# Altium schematic sheet S7CAS-PLEIADES-CARTE-MERE_Pxx_CNA.SchDoc
size Tabloid; SheetNumber: 11; SheetTotal: 18; Sheet_Name: CNA; Size: 11x17
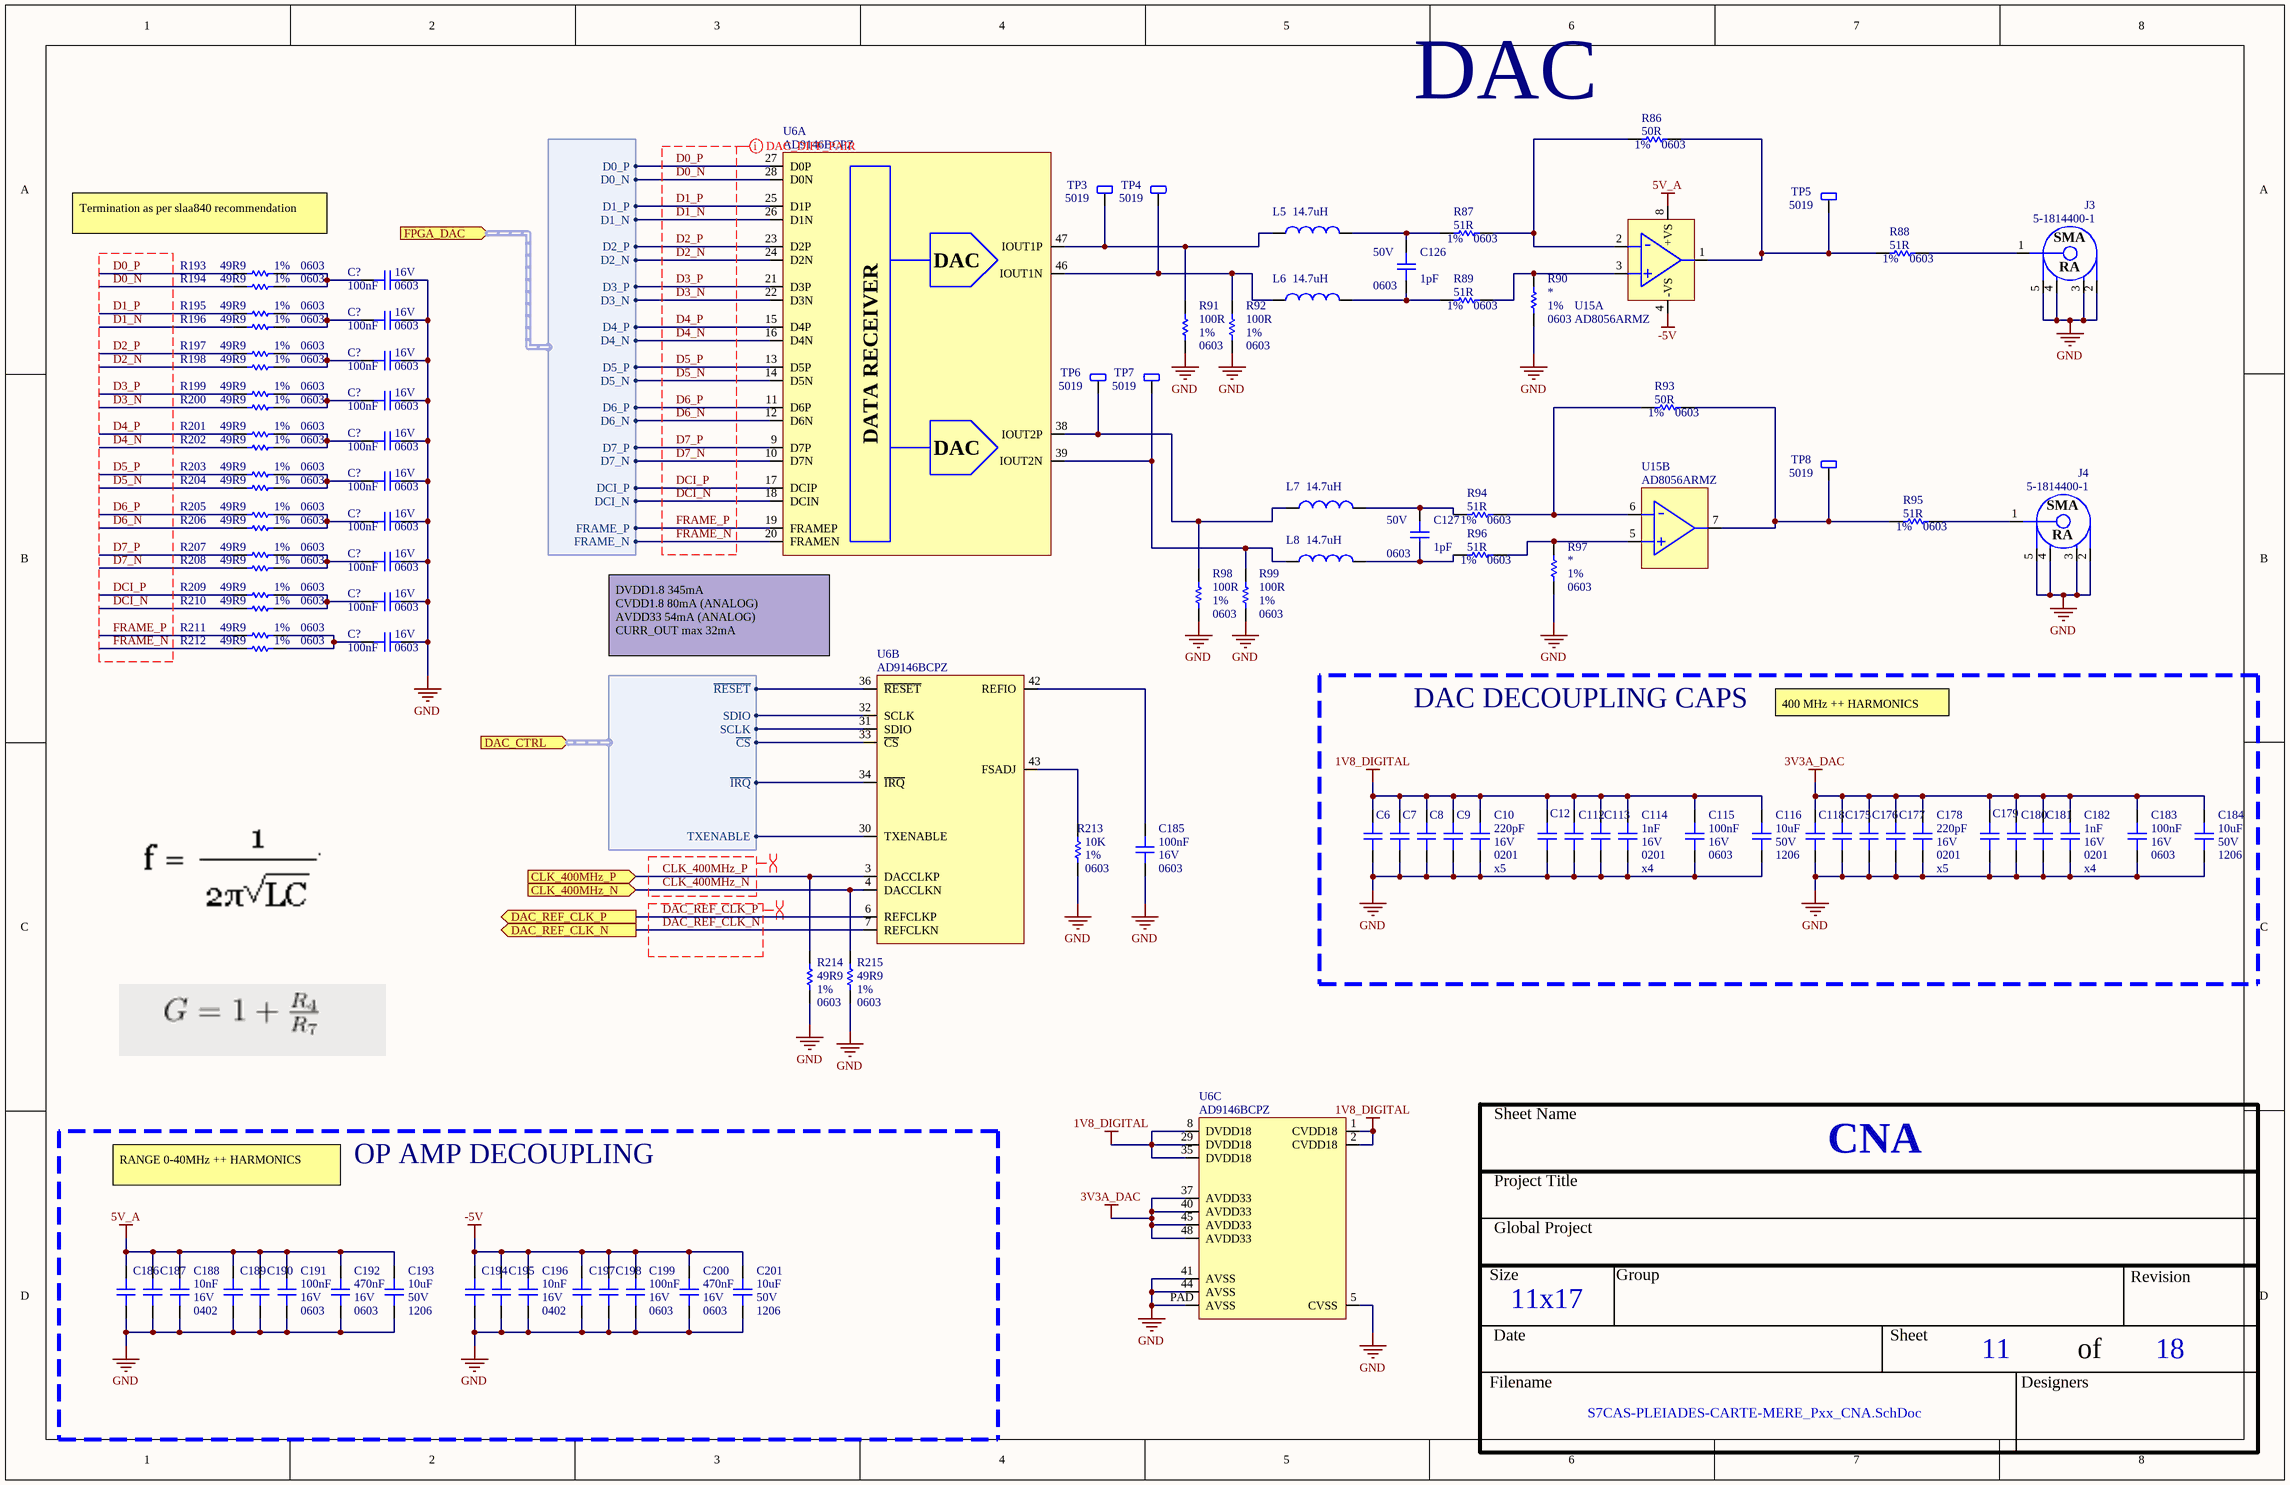
[diagram p0: S7CAS-PLEIADES-CARTE-MERE_Pxx_CNA.SchDoc]

## Parts
(Parts that share a designator on the sheet are numbered #1, #2 ... from top to bottom, then left to right.)
C6  CAP - 0201  [CAP_0201]  (value not drawn)
C7  CAP - 0201  [CAP_0201]  (value not drawn)
C8  CAP - 0201  [CAP_0201]  (value not drawn)
C9  CAP - 0201  [CAP_0201]  (value not drawn)
C10  value 220pF  Voltage: 16V  Package: 0201  [CAP_0201]  (hidden comment: CAP - 0201)
C12  CAP - 0201  [CAP_0201]  (value not drawn)
C112  CAP - 0201  [CAP_0201]  (value not drawn)
C113  CAP - 0201  [CAP_0201]  (value not drawn)
C114  value 1nF  Voltage: 16V  Package: 0201  [CAP_0201]  (hidden comment: CAP - 0201)
C115  value 100nF  Voltage: 16V  Package: 0603  [CAP_0603]  (hidden comment: CAP - 0603)
C116  value 10uF  Voltage: 50V  Package: 1206  [CAP_1206]  (hidden comment: CAP - 1206)
C118  CAP - 0201  [CAP_0201]  (value not drawn)
C126  value 1pF  Voltage: 50V  Package: 0603  [CAP_0603]  (hidden comment: CAP - 0603)
C127  value 1pF  Voltage: 50V  Package: 0603  [CAP_0603]  (hidden comment: CAP - 0603)
C175  CAP - 0201  [CAP_0201]  (value not drawn)
C176  CAP - 0201  [CAP_0201]  (value not drawn)
C177  CAP - 0201  [CAP_0201]  (value not drawn)
C178  value 220pF  Voltage: 16V  Package: 0201  [CAP_0201]  (hidden comment: CAP - 0201)
C179  CAP - 0201  [CAP_0201]  (value not drawn)
C180  CAP - 0201  [CAP_0201]  (value not drawn)
C181  CAP - 0201  [CAP_0201]  (value not drawn)
C182  value 1nF  Voltage: 16V  Package: 0201  [CAP_0201]  (hidden comment: CAP - 0201)
C183  value 100nF  Voltage: 16V  Package: 0603  [CAP_0603]  (hidden comment: CAP - 0603)
C184  value 10uF  Voltage: 50V  Package: 1206  [CAP_1206]  (hidden comment: CAP - 1206)
C185  value 100nF  Voltage: 16V  Package: 0603  [CAP_0603]  (hidden comment: CAP - 0603)
C186  CAP - 0402  [CAP_0402]  (value not drawn)
C187  CAP - 0402  [CAP_0402]  (value not drawn)
C188  value 10nF  Voltage: 16V  Package: 0402  [CAP_0402]  (hidden comment: CAP - 0402)
C189  CAP - 0603  [CAP_0603]  (value not drawn)
C190  CAP - 0603  [CAP_0603]  (value not drawn)
C191  value 100nF  Voltage: 16V  Package: 0603  [CAP_0603]  (hidden comment: CAP - 0603)
C192  value 470nF  Voltage: 16V  Package: 0603  [CAP_0603]  (hidden comment: CAP - 0603)
C193  value 10uF  Voltage: 50V  Package: 1206  [CAP_1206]  (hidden comment: CAP - 1206)
C194  CAP - 0402  [CAP_0402]  (value not drawn)
C195  CAP - 0402  [CAP_0402]  (value not drawn)
C196  value 10nF  Voltage: 16V  Package: 0402  [CAP_0402]  (hidden comment: CAP - 0402)
C197  CAP - 0603  [CAP_0603]  (value not drawn)
C198  CAP - 0603  [CAP_0603]  (value not drawn)
C199  value 100nF  Voltage: 16V  Package: 0603  [CAP_0603]  (hidden comment: CAP - 0603)
C200  value 470nF  Voltage: 16V  Package: 0603  [CAP_0603]  (hidden comment: CAP - 0603)
C201  value 10uF  Voltage: 50V  Package: 1206  [CAP_1206]  (hidden comment: CAP - 1206)
C?#1  value 100nF  Voltage: 16V  Package: 0603  [CAP_0603]  (hidden comment: CAP - 0603)
C?#2  value 100nF  Voltage: 16V  Package: 0603  [CAP_0603]  (hidden comment: CAP - 0603)
C?#3  value 100nF  Voltage: 16V  Package: 0603  [CAP_0603]  (hidden comment: CAP - 0603)
C?#4  value 100nF  Voltage: 16V  Package: 0603  [CAP_0603]  (hidden comment: CAP - 0603)
C?#5  value 100nF  Voltage: 16V  Package: 0603  [CAP_0603]  (hidden comment: CAP - 0603)
C?#6  value 100nF  Voltage: 16V  Package: 0603  [CAP_0603]  (hidden comment: CAP - 0603)
C?#7  value 100nF  Voltage: 16V  Package: 0603  [CAP_0603]  (hidden comment: CAP - 0603)
C?#8  value 100nF  Voltage: 16V  Package: 0603  [CAP_0603]  (hidden comment: CAP - 0603)
C?#9  value 100nF  Voltage: 16V  Package: 0603  [CAP_0603]  (hidden comment: CAP - 0603)
C?#10  value 100nF  Voltage: 16V  Package: 0603  [CAP_0603]  (hidden comment: CAP - 0603)
J3  5-1814400-1  [CONN_SMA_5-1814400-1]
J4  5-1814400-1  [CONN_SMA_5-1814400-1]
L5  value 14.7uH  [INDUCT_0603]  (hidden comment: INDUCTOR - 0603)
L6  value 14.7uH  [INDUCT_0603]  (hidden comment: INDUCTOR - 0603)
L7  value 14.7uH  [INDUCT_0603]  (hidden comment: INDUCTOR - 0603)
L8  value 14.7uH  [INDUCT_0603]  (hidden comment: INDUCTOR - 0603)
R86  value 50R  Package: 0603  Precision: 1%  [RES_0603]  (hidden comment: RES - 0603)
R87  value 51R  Package: 0603  Precision: 1%  [RES_0603]  (hidden comment: RES - 0603)
R88  value 51R  Package: 0603  Precision: 1%  [RES_0603]  (hidden comment: RES - 0603)
R89  value 51R  Package: 0603  Precision: 1%  [RES_0603]  (hidden comment: RES - 0603)
R90  Package: 0603  Precision: 1%  [RES_0603]  (hidden comment: RES - 0603)
R91  value 100R  Package: 0603  Precision: 1%  [RES_0603]  (hidden comment: RES - 0603)
R92  value 100R  Package: 0603  Precision: 1%  [RES_0603]  (hidden comment: RES - 0603)
R93  value 50R  Package: 0603  Precision: 1%  [RES_0603]  (hidden comment: RES - 0603)
R94  value 51R  Package: 0603  Precision: 1%  [RES_0603]  (hidden comment: RES - 0603)
R95  value 51R  Package: 0603  Precision: 1%  [RES_0603]  (hidden comment: RES - 0603)
R96  value 51R  Package: 0603  Precision: 1%  [RES_0603]  (hidden comment: RES - 0603)
R97  Package: 0603  Precision: 1%  [RES_0603]  (hidden comment: RES - 0603)
R98  value 100R  Package: 0603  Precision: 1%  [RES_0603]  (hidden comment: RES - 0603)
R99  value 100R  Package: 0603  Precision: 1%  [RES_0603]  (hidden comment: RES - 0603)
R193  value 49R9  Package: 0603  Precision: 1%  [RES_0603]  (hidden comment: RES - 0603)
R194  value 49R9  Package: 0603  Precision: 1%  [RES_0603]  (hidden comment: RES - 0603)
R195  value 49R9  Package: 0603  Precision: 1%  [RES_0603]  (hidden comment: RES - 0603)
R196  value 49R9  Package: 0603  Precision: 1%  [RES_0603]  (hidden comment: RES - 0603)
R197  value 49R9  Package: 0603  Precision: 1%  [RES_0603]  (hidden comment: RES - 0603)
R198  value 49R9  Package: 0603  Precision: 1%  [RES_0603]  (hidden comment: RES - 0603)
R199  value 49R9  Package: 0603  Precision: 1%  [RES_0603]  (hidden comment: RES - 0603)
R200  value 49R9  Package: 0603  Precision: 1%  [RES_0603]  (hidden comment: RES - 0603)
R201  value 49R9  Package: 0603  Precision: 1%  [RES_0603]  (hidden comment: RES - 0603)
R202  value 49R9  Package: 0603  Precision: 1%  [RES_0603]  (hidden comment: RES - 0603)
R203  value 49R9  Package: 0603  Precision: 1%  [RES_0603]  (hidden comment: RES - 0603)
R204  value 49R9  Package: 0603  Precision: 1%  [RES_0603]  (hidden comment: RES - 0603)
R205  value 49R9  Package: 0603  Precision: 1%  [RES_0603]  (hidden comment: RES - 0603)
R206  value 49R9  Package: 0603  Precision: 1%  [RES_0603]  (hidden comment: RES - 0603)
R207  value 49R9  Package: 0603  Precision: 1%  [RES_0603]  (hidden comment: RES - 0603)
R208  value 49R9  Package: 0603  Precision: 1%  [RES_0603]  (hidden comment: RES - 0603)
R209  value 49R9  Package: 0603  Precision: 1%  [RES_0603]  (hidden comment: RES - 0603)
R210  value 49R9  Package: 0603  Precision: 1%  [RES_0603]  (hidden comment: RES - 0603)
R211  value 49R9  Package: 0603  Precision: 1%  [RES_0603]  (hidden comment: RES - 0603)
R212  value 49R9  Package: 0603  Precision: 1%  [RES_0603]  (hidden comment: RES - 0603)
R213  value 10K  Package: 0603  Precision: 1%  [RES_0603]  (hidden comment: RES - 0603)
R214  value 49R9  Package: 0603  Precision: 1%  [RES_0603]  (hidden comment: RES - 0603)
R215  value 49R9  Package: 0603  Precision: 1%  [RES_0603]  (hidden comment: RES - 0603)
TP3  5019  [TPO_SMD_5019]
TP4  5019  [TPO_SMD_5019]
TP5  5019  [TPO_SMD_5019]
TP6  5019  [TPO_SMD_5019]
TP7  5019  [TPO_SMD_5019]
TP8  5019  [TPO_SMD_5019]
U6  AD9146BCPZ  [DAC_AD9146BCPZ]  (parts A,B,C of 3)
U15  AD8056ARMZ  [OPAMP_AD8056ARMZ]  (parts A,B of 2)

## Blocks framed on the sheet
DAC DECOUPLING CAPS: C6-C10 C12 C112-C116 C118 C175-C184
OP AMP DECOUPLING: C186-C201

## Ports
CLK_400MHz_N (in, see S7CAS-PLEIADES-CARTE-MERE_Pxx_FLASH_PHY_CLOCK[5A]), CLK_400MHz_P (in, see S7CAS-PLEIADES-CARTE-MERE_Pxx_FLASH_PHY_CLOCK[5A]), DAC_CTRL (in, harness DAC_CTRL_HARNESS, see S7CAS-PLEIADES-CARTE-MERE_Pxx_FPGA_bank2_4[6A]), DAC_REF_CLK_N (out, see S7CAS-PLEIADES-CARTE-MERE_Pxx_FPGA_bank2_4[3C]), DAC_REF_CLK_P (out, see S7CAS-PLEIADES-CARTE-MERE_Pxx_FPGA_bank2_4[3C]), FPGA_DAC (in, harness DAC_HARNESS, see S7CAS-PLEIADES-CARTE-MERE_Pxx_FPGA_bank2_4[6B])

## Harnesses
DAC_HARNESS: D0_P, D1_P, D2_P, D3_P, D4_P, D5_P, D6_P, D7_P, DCI_P, DCI_N, FRAME_P, FRAME_N, D2_N, D4_N, D6_N, D7_N, D5_N, D1_N, D3_N, D0_N
DAC_CTRL_HARNESS: ~{RESET}, SDIO, ~{CS}, SCLK, ~{IRQ}, TXENABLE

## Nets
1V8_DIGITAL: C6.2 C7.2 C8.2 C9.2 C10.2 C12.2 C112.2 C113.2 C114.2 C115.2 C116.2 U6.1(CVDD18) U6.2(CVDD18) U6.8(DVDD18) U6.29(DVDD18) U6.35(DVDD18)
3V3A_DAC: C118.2 C175.2 C176.2 C177.2 C178.2 C179.2 C180.2 C181.2 C182.2 C183.2 C184.2 U6.37(AVDD33) U6.40(AVDD33) U6.45(AVDD33) U6.48(AVDD33)
5V_A: C186.2 C187.2 C188.2 C189.2 C190.2 C191.2 C192.2 C193.2 U15.8(+VS)
-5V: C194.2 C195.2 C196.2 C197.2 C198.2 C199.2 C200.2 C201.2 U15.4(-VS)
GND: C6.1 C7.1 C8.1 C9.1 C10.1 C12.1 C112.1 C113.1 C114.1 C115.1 C116.1 C118.1 C175.1 C176.1 C177.1 C178.1 C179.1 C180.1 C181.1 C182.1 C183.1 C184.1 C185.1 C186.1 C187.1 C188.1 C189.1 C190.1 C191.1 C192.1 C193.1 C194.1 C195.1 C196.1 C197.1 C198.1 C199.1 C200.1 C201.1 C?#1.1 C?#2.1 C?#3.1 C?#4.1 C?#5.1 C?#6.1 C?#7.1 C?#8.1 C?#9.1 C?#10.1 J3.2 J3.3 J3.4 J3.5 J4.2 J4.3 J4.4 J4.5 R90.1 R91.1 R92.1 R97.1 R98.1 R99.1 R213.1 R214.1 R215.1 U6.5(CVSS) U6.41(AVSS) U6.44(AVSS) U6.PAD(AVSS)
CLK_400MHz_N: R215.2 U6.4(DACCLKN) ; port CLK_400MHz_N
CLK_400MHz_P: R214.2 U6.3(DACCLKP) ; port CLK_400MHz_P
D0_N: R194.2 U6.28(D0N) ; port FPGA_DAC.D0_N
D0_P: R193.2 U6.27(D0P) ; port FPGA_DAC.D0_P
D1_N: R196.2 U6.26(D1N) ; port FPGA_DAC.D1_N
D1_P: R195.2 U6.25(D1P) ; port FPGA_DAC.D1_P
D2_N: R198.2 U6.24(D2N) ; port FPGA_DAC.D2_N
D2_P: R197.2 U6.23(D2P) ; port FPGA_DAC.D2_P
D3_N: R200.2 U6.22(D3N) ; port FPGA_DAC.D3_N
D3_P: R199.2 U6.21(D3P) ; port FPGA_DAC.D3_P
D4_N: R202.2 U6.16(D4N) ; port FPGA_DAC.D4_N
D4_P: R201.2 U6.15(D4P) ; port FPGA_DAC.D4_P
D5_N: R204.2 U6.14(D5N) ; port FPGA_DAC.D5_N
D5_P: R203.2 U6.13(D5P) ; port FPGA_DAC.D5_P
D6_N: R206.2 U6.12(D6N) ; port FPGA_DAC.D6_N
D6_P: R205.2 U6.11(D6P) ; port FPGA_DAC.D6_P
D7_N: R208.2 U6.10(D7N) ; port FPGA_DAC.D7_N
D7_P: R207.2 U6.9(D7P) ; port FPGA_DAC.D7_P
DAC_REF_CLK_N: U6.7(REFCLKN) ; port DAC_REF_CLK_N
DAC_REF_CLK_P: U6.6(REFCLKP) ; port DAC_REF_CLK_P
DCI_N: R210.2 U6.18(DCIN) ; port FPGA_DAC.DCI_N
DCI_P: R209.2 U6.17(DCIP) ; port FPGA_DAC.DCI_P
FRAME_N: R212.2 U6.20(FRAMEN) ; port FPGA_DAC.FRAME_N
FRAME_P: R211.2 U6.19(FRAMEP) ; port FPGA_DAC.FRAME_P
NetC126_1: C126.1 L6.2 R89.2
NetC126_2: C126.2 L5.2 R87.2
NetC127_1: C127.1 L8.2 R96.2
NetC127_2: C127.2 L7.2 R94.2
NetC185_2: C185.2 U6.42(REFIO)
NetC?#1_2: C?#1.2 R193.1 R194.1
NetC?#2_2: C?#2.2 R195.1 R196.1
NetC?#3_2: C?#3.2 R197.1 R198.1
NetC?#4_2: C?#4.2 R199.1 R200.1
NetC?#5_2: C?#5.2 R201.1 R202.1
NetC?#6_2: C?#6.2 R203.1 R204.1
NetC?#7_2: C?#7.2 R205.1 R206.1
NetC?#8_2: C?#8.2 R207.1 R208.1
NetC?#9_2: C?#9.2 R209.1 R210.1
NetC?#10_2: C?#10.2 R211.1 R212.1
NetJ3_1: J3.1 R88.1
NetJ4_1: J4.1 R95.1
NetL5_1: L5.1 R91.2 TP3.1 U6.47(IOUT1P)
NetL6_1: L6.1 R92.2 TP4.1 U6.46(IOUT1N)
NetL7_1: L7.1 R98.2 TP6.1 U6.38(IOUT2P)
NetL8_1: L8.1 R99.2 TP7.1 U6.39(IOUT2N)
NetR86_1: R86.1 R88.2 TP5.1 U15.1(OUT1)
NetR86_2: R86.2 R87.1 U15.2(-IN1)
NetR89_1: R89.1 R90.2 U15.3(+IN1)
NetR93_1: R93.1 R95.2 TP8.1 U15.7(OUT2)
NetR93_2: R93.2 R94.1 U15.6(-IN2)
NetR96_1: R96.1 R97.2 U15.5(+IN2)
NetR213_2: R213.2 U6.43(FSADJ)
NetU6_30: U6.30(TXENABLE) ; port DAC_CTRL.TXENABLE
NetU6_31: U6.31(SDIO) ; port DAC_CTRL.SCLK
NetU6_32: U6.32(SCLK) ; port DAC_CTRL.SDIO
NetU6_33: U6.33(~{CS}) ; port DAC_CTRL.~{CS}
NetU6_34: U6.34(~{IRQ}) ; port DAC_CTRL.~{IRQ}
NetU6_36: U6.36(~{RESET}) ; port DAC_CTRL.~{RESET}

## Layout directives
differential pair; differential pair class CLK_400MHz_PAIR: CLK_400MHz_N, CLK_400MHz_P, DAC_REF_CLK_N, DAC_REF_CLK_P
differential pair: D0_N, D0_P, D1_N, D1_P, D2_N, D2_P, D3_N, D3_P, D4_N, D4_P, D5_N, D5_P, D6_N, D6_P, D7_N, D7_P, DCI_N, DCI_P, FRAME_N, FRAME_P

## Notes on the sheet
- DAC
- Termination as per slaa840 recommendation
- (near U6) DVDD1.8 345mA
  CVDD1.8 80mA (ANALOG)
  AVDD33 54mA (ANALOG)
  CURR_OUT max 32mA
- 400 MHz ++ HARMONICS
- (near C10) x5
- (near C114) x4
- (near C178) x5
- (near C182) x4
- RANGE 0-40MHz ++ HARMONICS
- Sheet Name
- Project Title
- Global Project
- Size
- Group
- Revision
- Date
- Sheet
- of
- Filename
- Designers
- (in symbol CONN_SMA_5-1814400-1) SMA; RA
- (in symbol DAC_AD9146BCPZ, part A) DAC; DATA RECEIVER

## Library data of the parts
C6-C9 C118 C175-C177 = CAP - 0201: Precision: 10%; Voltage: 16V; Value: 220pF; Current: *; CreatedBy: Jonathan Bouchard; Power: *; Package: 0201; Supplier 1: Arrow Electronics; Supplier Part Number 1: GRM033R71C221KA01D
C10 C114 C178 C182 = CAP - 0201: Precision: 10%; Current: *; CreatedBy: Jonathan Bouchard; Power: *
  C10 C178: Supplier 1: Arrow Electronics; Supplier Part Number 1: GRM033R71C221KA01D
  C114 C182: Supplier 1: Avnet; Supplier Part Number 1: GRM033R71C102KA01J
C12 C112 C113 C179-C181 = CAP - 0201: Precision: 10%; Voltage: 16V; Value: 1nF; Current: *; CreatedBy: Jonathan Bouchard; Power: *; Package: 0201; Supplier 1: Avnet; Supplier Part Number 1: GRM033R71C102KA01J
C115 C126 C127 C183 C185 C191 C192 C199 C200 C?#1-C?#10 = CAP - 0603: Precision: 10%; Current: *; CreatedBy: Jonathan Bouchard; Power: *
  C115 C183 C185 C191 C199 C?#1-C?#10: Supplier 1: Arrow Electronics; Supplier Part Number 1: CL10B104KO8NNNC
  C192 C200: Supplier 1: Arrow Electronics; Supplier Part Number 1: C1608X7R1C474K080AC
C116 C184 C193 C201 = CAP - 1206: Precision: 10%; Current: *; CreatedBy: Jonathan Bouchard; Power: *; Supplier 1: Avnet; Supplier Part Number 1: CL31A106MBHNNNE
C186 C187 C194 C195 = CAP - 0402: Precision: 10%; Voltage: 16V; Value: 10nF; Current: *; CreatedBy: Jonathan Bouchard; Power: *; Package: 0402; Supplier 1: Arrow Electronics; Supplier Part Number 1: GRM155R61A224KE19D
C188 C196 = CAP - 0402: Precision: 10%; Current: *; CreatedBy: Jonathan Bouchard; Power: *; Supplier 1: Arrow Electronics; Supplier Part Number 1: GRM155R61A224KE19D
C189 C190 C197 C198 = CAP - 0603: Precision: 10%; Voltage: 16V; Value: 100nF; Current: *; CreatedBy: Jonathan Bouchard; Power: *; Package: 0603; Supplier 1: Arrow Electronics; Supplier Part Number 1: CL10B104KO8NNNC
J3 J4 = CONN_SMA_5-1814400-1: CONN -  SMA JACK R/A 50 OHM - TH; Mfg: TE Connectivity AMP Connectors; Voltage: *; Current: *; Power: *; Mfg Part Number: 5-1814400-1; HelpURL: http://www.te.com/commerce/DocumentDelivery/DDEController?Action=srchrtrv&DocNm=1814400&DocType=Customer+Drawing&DocLang=English; CreatedBy: Jonathan Bouchard; Temperature: -55°C ~ 85°C; Value: *; Precision: *; Package: TH-5; Supplier 1: Digikey; Supplier Part Number 1: A97593-ND
L5-L8 = INDUCT - 0603: GRAMS Lib Spec: 2.7; Saturation Val: [SATURATION]
TP3-TP8 = TPO_SMD_5019: TPO - PC TEST POINT MINI - SMD; Manufacturer #1: Keystone Electronics; Value: 3.81mm x 2.03mm; Polarized: No; Magnetic Material: UNKNOWN; GRAMS Lib Spec: 2.8; Current Rating: *; Manufacturer #2: *; Note: *; Power Max: *; Part Number #2: *; HelpURL: https://www.digikey.ca/product-detail/en/keystone-electronics/5019/36-5019CT-ND/3907344; Supplier 1: Digi-Key; Supplier Part Number 1: 36-5019CT-ND; Assembly Type: SMD; Part Number #1: 5019; Package: SMD; CreatedBy/Date: Olivier Bernard / 5/12/2017; Temperature: *; Tolerance: *; VerifiedBy: Caroline Paulin / 5 juillet 2018; Voltage Rating: *; Cryo: UNKNOWN
U6 = DAC_AD9146BCPZ: DAC - 16BIT SRL HIGH SPEED - QFN-48; Voltage: 3.13 V ~ 3.47 V / 1.71 V ~ 1.89 V; Mfg: Analog Devices Inc.; Current: *; Power: *; Mfg Part Number: AD9146BCPZ; HelpURL: http://www.analog.com/media/en/technical-documentation/data-sheets/AD9146.PDF; CreatedBy: Jonathan Bouchard; Temperature: -40°C ~ 85°C; Value: *; Precision: 16 Bit; Package: QFN-48; Supplier 1: Mouser; Supplier Part Number 1: 584-AD9146BCPZ
U15 = OPAMP_AD8056ARMZ: OPAMP - VFB 300MHZ - 8MSOP; Voltage: 8 V ~ 12 V, ±4 V ~ 6 V; Current: 60mA; Mfg: Analog Devices; Power: *; Mfg Part Number: AD8056ARMZ; HelpURL: http://www.analog.com/media/en/technical-documentation/data-sheets/AD8055_8056.pdf; CreatedBy: Jonathan Bouchard; Temperature: -40°C ~ 125°C; Value: *; Precision: *; Package: MSOP-8; Supplier 1: Digikey; Supplier Part Number 1: AD8056ARMZ-REEL7CT-ND
R86-R99 R193-R215 = RES - 0603: Current: *; CreatedBy: Jonathan Bouchard
  R90 R97: Value: *
  R193-R212 R214 R215: Supplier 1: Mouser; Supplier Part Number 1: 667-ERJ-3EKF49R9V
  R213: Supplier 1: Arrow Electronics; Supplier Part Number 1: RMCF0603FT10K0